# Altium project Research_protoype.PrjPcb
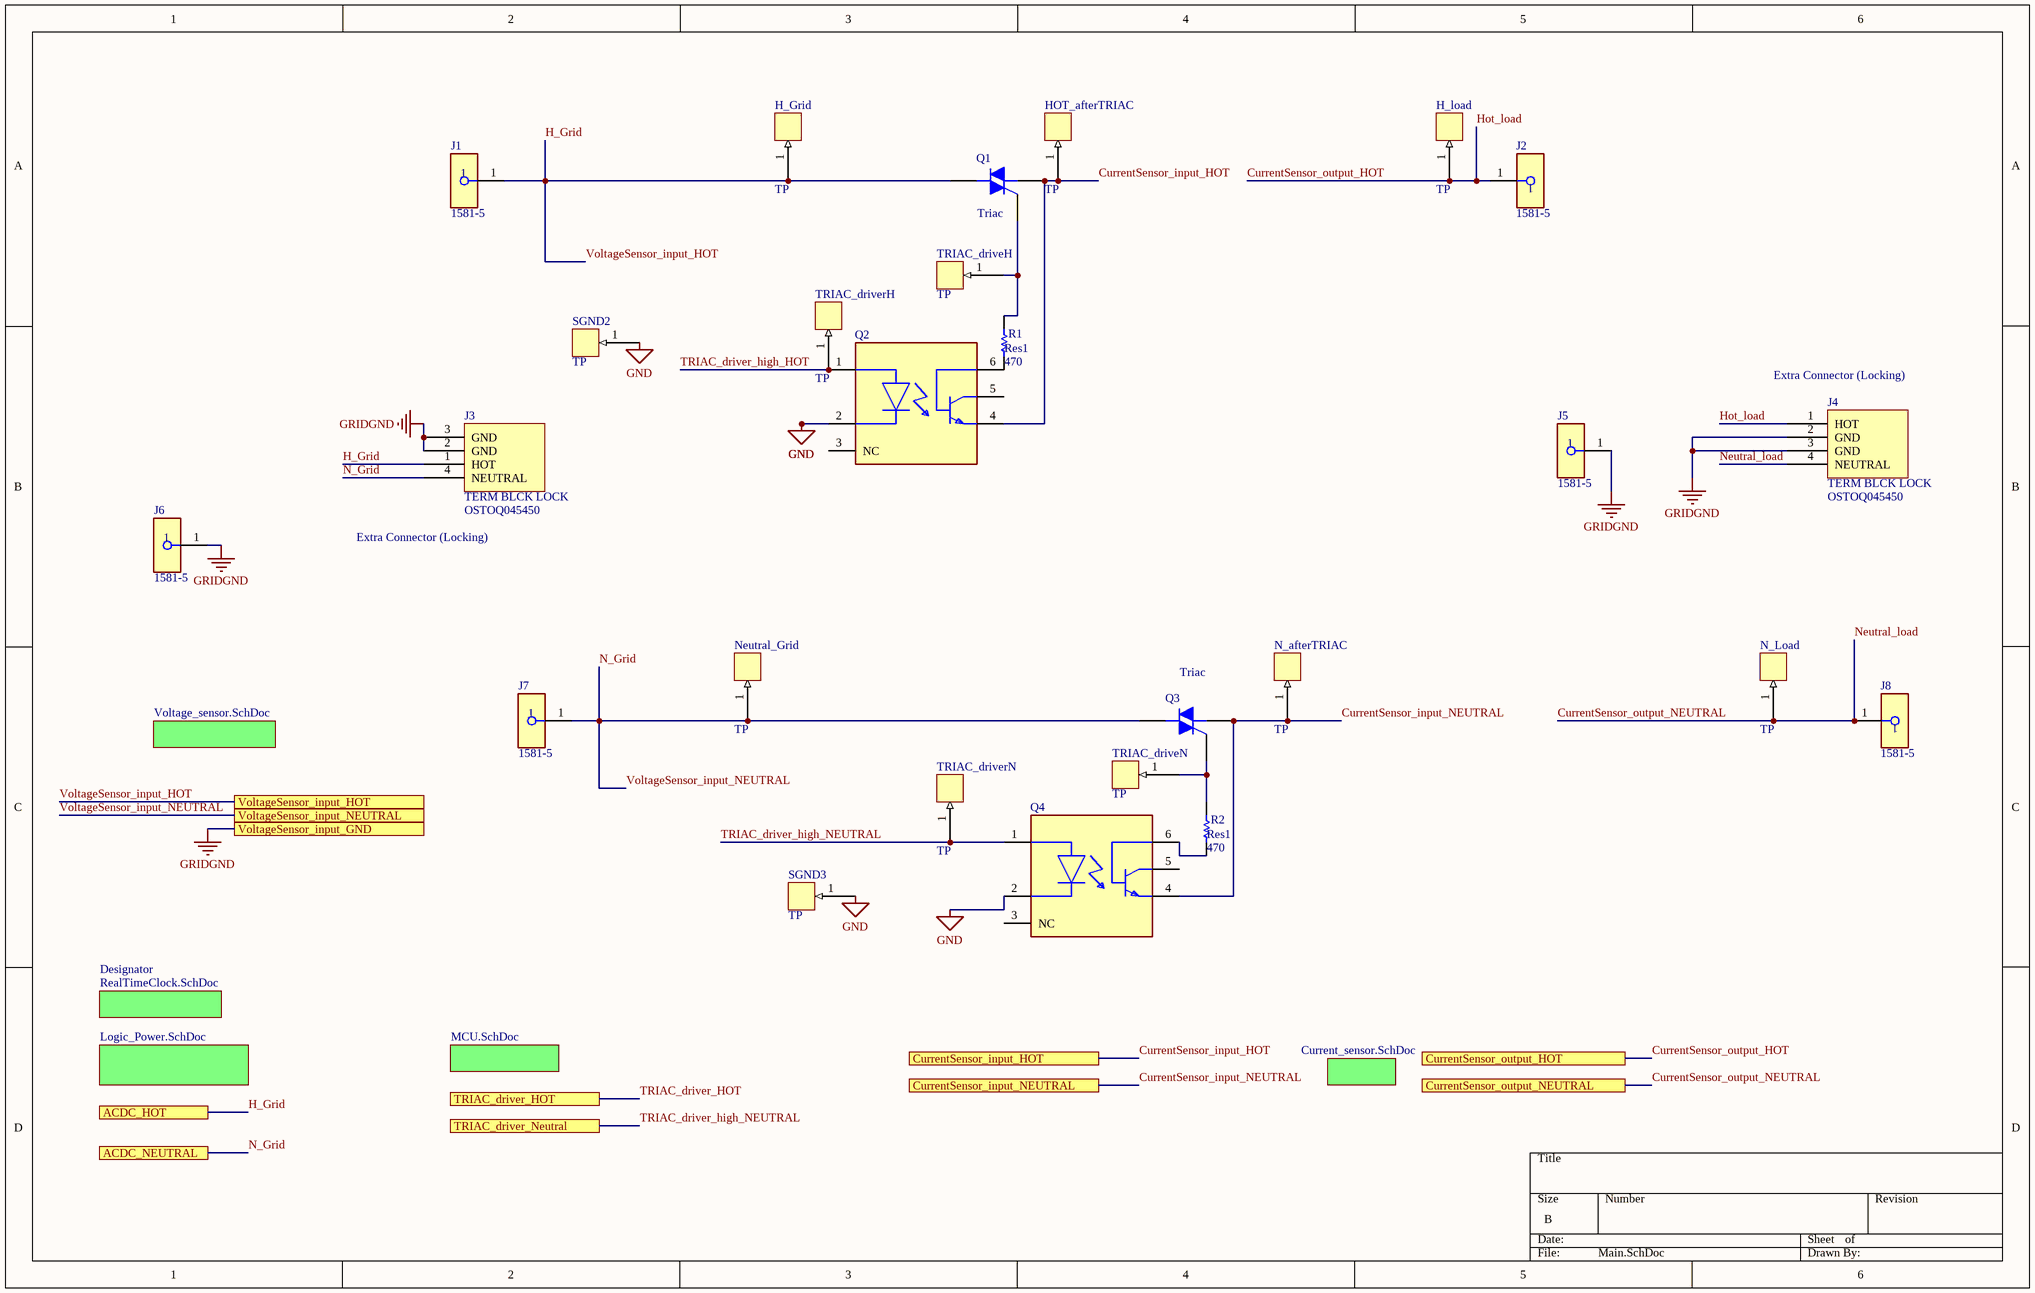
[diagram p0: Main.SchDoc]
6 sheets, 124 parts. Net scope: flat (ports and power ports of the same name join across sheets).
Board file: Research_prototypePCB.PcbDoc
Sheets:
  Main.SchDoc
     = Current_sensor.SchDoc
     = Voltage_sensor.SchDoc
     = MCU.SchDoc
     = Logic_Power.SchDoc
    Designator = RealTimeClock.SchDoc

## Sheet Main.SchDoc
size B; SheetNumber: 1; SheetTotal: 6; SPICEModelCacheZOZTKGSK: <root> / <DocumentId>ZOZTKGSK</DocumentId> / <CacheFrame Number="0"> / <Model Name="mac15a8" Kind="CKT"> / <Text>*MAC15A8 MCE 2-27-96 / *600V 15A pkg:TO-220 2,3,1 / .SUBCKT MAC15A8   1  2  3 / *     TERMINALS: MT2 G MT1 / QN1  5 4 3  NOUT OFF / QN2 11 6 7  NOUT OFF / QP1 6 11 3  POUT OFF / QP2  4 5 7  POUT OFF / DF  4  5  DZ OFF / DR  6 11  DZ OFF / RF  4 6  60MEG / RT2 1 7  18.8M / RH  7 6  87.5 / RGP 8 3  23.1 / RG  2 8  11.5 / RS  8 4  102 / DN  9 2  DIN OFF / RN  9 3  41.6 / GNN  6 7 9 3 15.2M / GNP  4 5 9 3 18.1M / DP 2 10  DIP OFF / RP 10 3  29.5 / GP  7 6 10 3 10.3M / .MODEL DIN  D (IS=45.8F) / .MODEL DIP  D (IS=45.8F N=1.2) / .MODEL DZ   D (IS=45.8F N=1.5 IBV=10U BV=600) / .MODEL POUT PNP (IS=45.8F BF=5 CJE=4.02N TF=38.2U) / .MODEL NOUT NPN (IS=45.8F BF=20 CJE=4.02N CJC=804P TF=2.55U) / .ENDS MAC15A8</Text> / </Model> / </CacheFrame> / </root>

### Parts
(Parts that share a designator on the sheet are numbered #1, #2 ... from top to bottom, then left to right.)
H_Grid#1  TP  [TP]
H_load  TP  [TP]
HOT_afterTRIAC  TP  [TP]
J1  1581-5  [FP-1581-5-MFG]
J2  1581-5  [FP-1581-5-MFG]
J3  OSTOQ045450  [block]
J4  OSTOQ045450  [block]
J5  1581-5  [FP-1581-5-MFG]
J6  1581-5  [FP-1581-5-MFG]
J7  1581-5  [FP-1581-5-MFG]
J8  1581-5  [FP-1581-5-MFG]
N_afterTRIAC  TP  [TP]
N_Load  TP  [TP]
Neutral_Grid  TP  [TP]
Q1  Triac  [TO-220AB]
Q2  (no value)  [FP-22530-MFG]
Q3  Triac  [TO-220AB]
Q4  (no value)  [FP-22530-MFG]
R1  Res1  value 470  [0603]
R2  Res1  value 470  [0603]
SGND2  TP  [TP]
SGND3  TP  [TP]
TRIAC_driveH  TP  [TP]
TRIAC_driveN  TP  [TP]
TRIAC_driverH  TP  [TP]
TRIAC_driverN  TP  [TP]

### Sub-sheets
Designator = RealTimeClock.SchDoc: no entries
? = Current_sensor.SchDoc: no entries
? = Voltage_sensor.SchDoc: no entries
? = MCU.SchDoc: no entries
? = Logic_Power.SchDoc: no entries

### Ports
ACDC_HOT, ACDC_NEUTRAL, CurrentSensor_input_HOT, CurrentSensor_input_NEUTRAL, CurrentSensor_output_HOT, CurrentSensor_output_NEUTRAL, TRIAC_driver_HOT, TRIAC_driver_Neutral, VoltageSensor_input_GND, VoltageSensor_input_HOT, VoltageSensor_input_NEUTRAL

### Nets
GND: Q2.2(C) Q4.2(C) SGND2.1 SGND3.1
GRIDGND: J3.2(GND) J3.3(GND) J4.2(GND) J4.3(GND) J5.1 J6.1 ; port VoltageSensor_input_GND
CurrentSensor_input_HOT: HOT_afterTRIAC.1 Q1.1(M1) Q2.4(E) ; port CurrentSensor_input_HOT
CurrentSensor_input_NEUTRAL: N_afterTRIAC.1 Q3.1(M1) Q4.4(E) ; port CurrentSensor_input_NEUTRAL
CurrentSensor_output_HOT: H_load.1 J2.1 J4.1(HOT) ; port CurrentSensor_output_HOT  [also labelled Hot_load]
CurrentSensor_output_NEUTRAL: J4.4(NEUTRAL) J8.1 N_Load.1 ; port CurrentSensor_output_NEUTRAL  [also labelled Neutral_load]
H_Grid: H_Grid#1.1 J1.1 J3.1(HOT) Q1.2(M2) ; port ACDC_HOT, port VoltageSensor_input_HOT  [also labelled VoltageSensor_input_HOT]
N_Grid: J3.4(NEUTRAL) J7.1 Neutral_Grid.1 Q3.2(M2) ; port ACDC_NEUTRAL, port VoltageSensor_input_NEUTRAL  [also labelled VoltageSensor_input_NEUTRAL]  [project net N]
TRIAC_driver_high_HOT: Q2.1(A) TRIAC_driverH.1
TRIAC_driver_high_NEUTRAL: Q4.1(A) TRIAC_driverN.1 ; port TRIAC_driver_Neutral
NetQ1_3: Q1.3(G) R1.2 TRIAC_driveH.1
NetQ2_6: Q2.6(B) R1.1
NetQ3_3: Q3.3(G) R2.2 TRIAC_driveN.1
NetQ4_6: Q4.6(B) R2.1

Not connected (* = marked no-connect by the designer): Q2 3(NC) 5(C); Q4 3(NC) 5(C)

### Notes on the sheet
- (near J4) Extra Connector (Locking)
- Extra Connector (Locking)
- (in symbol OSTOQ045450) TERM BLCK LOCK

### Library data of the parts
J1 J2 J5-J8 = CMP-73906-000011-1: CONN BANANA JACK TURRET GREEN; Body Material: PC; Number of Contacts: 1; Max Current Rating: 15A; Voltage Rating (AC): 30V; Insulation: Mating End Insulated; Voltage Rating: 2.5kV; Voltage Rating (DC): 60V; Gender: Female; Height: 0.25inch; Mount: Panel; RoHS Compliant: Yes; Length: 1.22inch; Orientation: Straight; Diameter: 4.22mm; Lead Free: Lead Free; Package Quantity: 1; Termination: Turret; Current Rating: 15A; Packaging: Bag; Series: 1581; REACH SVHC: No SVHC; Number of Positions: 1; Contact Plating: Tin; Housing Color: Green; Contact Material: Brass; Insulation Material: Polycarbonate; Weight: 0.126lb; Number of Ports: 1; Color: Green; Housing Material: Polycarbonate; Width: 4inch
Q1 Q3 = Triac: Silicon Bidirectional Triode Thyristor; Note: Pin 2 is electrically connected to Pin 4 (TAB); Published: 29-Sep-2000; LatestRevisionDate: 17-Jul-2002; LatestRevisionNote: Re-released for DXP Platform.; DatasheetVersion: 1999; PackageReference: 369-03; Publisher: Altium Limited; PackageDescription: TO, Thru-Hole, Vertical, Heatsink Mounted; 3 In-Line Leads; Pitch 2.28 mm; ComponentLink2Description: Digikey Link
  Q1: ComponentLink2URL: https://www.digikey.com/en/products/detail/ween-semiconductors/MAC223A6-12a7/1156589
  Q3: ComponentLink2URL: https://www.digikey.com/en/products/detail/ween-semiconductors/MAC223A6-127/1156589
Q2 Q4 = CMP-2000-05429-2: OPTOISO 5KV TRANS W/BASE 6DIP; Max Input Current: 60mA; Max Output Voltage: 70V; Power Dissipation: 150mW; Number of Elements: 1; Voltage Rating (DC): 32V; Reverse Breakdown Voltage: 6V; Fall Time: 14us; Current Transfer Ratio: 200%; Turn-Off Delay Time: 2.3us; Forward Voltage: 1.65V; Max Collector Current: 100mA; Collector Emitter Saturation Voltage: 400mV; Approvals: VDE; Rise Time: 3us; Package Quantity: 2000; Contact Plating: Tin; Max Power Dissipation: 150mW; Packaging: Rail/Tube; Number of Channels: 1; Lead Free: Lead Free; Mount: Through Hole; Output Voltage: 70V; Min Operating Temperature: -55°C; Case/Package: DIP; Forward Current: 60mA; Collector Emitter Voltage (VCEO): 70V; Max Operating Temperature: 100°C; Input Current: 60mA; Radiation Hardening: No; Number of Pins: 6; Output Current per Channel: 100mA; Isolation Voltage: 5kV; Collector Emitter Breakdown Voltage: 70V; Turn-On Delay Time: 3us
R1 R2 = Res1: Resistor; Published: 8-Jun-2000; LatestRevisionDate: 17-Jul-2002; LatestRevisionNote: Re-released for DXP Platform.; PackageReference: AXIAL-0.3; Publisher: Altium Limited; PackageDescription: Axial Device, Thru-Hole; 2 Leads; 0.3 in Pin Spacing

## Sheet Current_sensor.SchDoc
size A; SheetNumber: 3; SheetTotal: 6; SPICEModelCacheOXJWTCKB: <root> / <DocumentId>OXJWTCKB</DocumentId> / <CacheFrame Number="0"> / <Model Name="cap" Kind="MDL"> / <Text>*Default semiconductor capacitor / .MODEL CAP C()</Text> / </Model> / </CacheFrame> / </root>
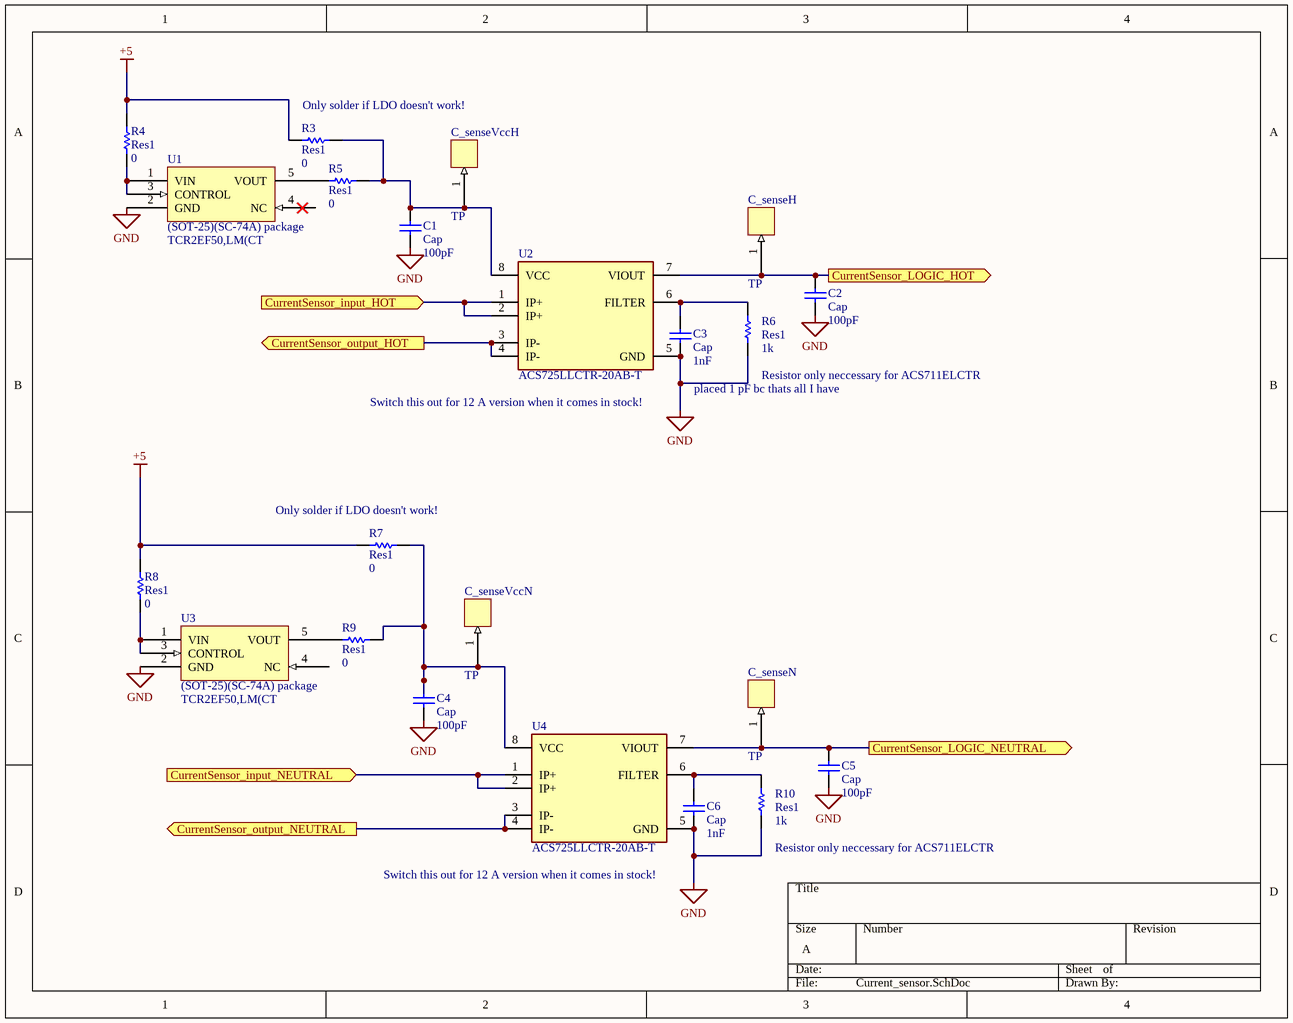
[diagram p1: Current_sensor.SchDoc]

### Parts
C1  Cap  value 100pF  [0603]
C2  Cap  value 100pF  [0603]
C3  Cap  value 1nF  [0603]
C4  Cap  value 100pF  [0603]
C5  Cap  value 100pF  [0603]
C6  Cap  value 1nF  [0603]
C_senseH  TP  [TP]
C_senseN  TP  [TP]
C_senseVccH  TP  [TP]
C_senseVccN  TP  [TP]
R3  Res1  value 0  [0603]
R4  Res1  value 0  [0603]
R5  Res1  value 0  [0603]
R6  Res1  value 1k  [0603]
R7  Res1  value 0  [0603]
R8  Res1  value 0  [0603]
R9  Res1  value 0  [0603]
R10  Res1  value 1k  [0603]
U1  TCR2EF50,LM(CT  [SOT95P275X130-5N]
U2  ACS725LLCTR-20AB-T  [FP-LCN-8-IPC_B]
U3  TCR2EF50,LM(CT  [SOT95P275X130-5N]
U4  ACS725LLCTR-20AB-T  [FP-LCN-8-IPC_B]

### Ports
CurrentSensor_input_HOT (in), CurrentSensor_input_NEUTRAL (in), CurrentSensor_LOGIC_HOT (out), CurrentSensor_LOGIC_NEUTRAL (out), CurrentSensor_output_HOT (out), CurrentSensor_output_NEUTRAL (out)

### Nets
+5: R3.2 R4.1 R7.2 R8.1
GND: C1.1 C2.1 C3.1 C4.1 C5.1 C6.1 R6.1 R10.1 U1.2(GND) U2.5(GND) U3.2(GND) U4.5(GND)
CurrentSensor_input_HOT: U2.1(IP+) U2.2(IP+) ; port CurrentSensor_input_HOT
CurrentSensor_input_NEUTRAL: U4.1(IP+) U4.2(IP+) ; port CurrentSensor_input_NEUTRAL
CurrentSensor_output_HOT: U2.3(IP-) U2.4(IP-) ; port CurrentSensor_output_HOT
CurrentSensor_output_NEUTRAL: U4.3(IP-) U4.4(IP-) ; port CurrentSensor_output_NEUTRAL
NetC1_2: C1.2 C_senseVccH.1 R3.1 R5.1 U2.8(VCC)
NetC2_2: C2.2 C_senseH.1 U2.7(VIOUT) ; port CurrentSensor_LOGIC_HOT
NetC3_2: C3.2 R6.2 U2.6(FILTER)
NetC4_2: C4.2 C_senseVccN.1 R7.1 R9.1 U4.8(VCC)
NetC5_2: C5.2 C_senseN.1 U4.7(VIOUT) ; port CurrentSensor_LOGIC_NEUTRAL
NetC6_2: C6.2 R10.2 U4.6(FILTER)
NetR4_2: R4.2 U1.1(VIN) U1.3(CONTROL)
NetR5_2: R5.2 U1.5(VOUT)
NetR8_2: R8.2 U3.1(VIN) U3.3(CONTROL)
NetR9_2: R9.2 U3.5(VOUT)

Not connected (* = marked no-connect by the designer): U1 4(NC); U3 4(NC)

### Notes on the sheet
- (near R3) Only solder if LDO doesn't work!
- Switch this out for 12 A version when it comes in stock!
- placed 1 pF bc thats all I have
- (near R6) Resistor only neccessary for ACS711ELCTR
- (near R7) Only solder if LDO doesn't work!
- (near R10) Resistor only neccessary for ACS711ELCTR
- (in symbol TCR2EF50,LM(CT) (SOT-25)(SC-74A) package

### Library data of the parts
C1-C6 = Cap: Capacitor; Published: 8-Jun-2000; LatestRevisionDate: 17-Jul-2002; LatestRevisionNote: Re-released for DXP Platform.; PackageReference: RAD-0.3; Publisher: Altium Limited; PackageDescription: Radial Cap, Thru-Hole; 2 Leads; 0.3 in Pin Spacing
R3-R10 = Res1: Resistor; Published: 8-Jun-2000; LatestRevisionDate: 17-Jul-2002; LatestRevisionNote: Re-released for DXP Platform.; PackageReference: AXIAL-0.3; Publisher: Altium Limited; PackageDescription: Axial Device, Thru-Hole; 2 Leads; 0.3 in Pin Spacing
U2 U4 = CMP-82923-000001-3: SENSOR CURRENT HALL 20A AC/DC; Accuracy: 0.8%; Linearity: 1.5%; Polarity: Bidirectional; Bandwidth: 120kHz; Number of Channels: 1; Sensitivity: 66mV/A; Quiescent Current: 10mA; Response Time: 4us; Max Supply Current: 14mA; Frequency: 120kHz; Min Operating Temperature: -40°C; Max Operating Temperature: 150°C; Case/Package: SOIC; Current Sensing: 20A; Packaging: Tape and Reel; Number of Pins: 8; Mount: Surface Mount; RoHS Compliant: Yes

## Sheet Voltage_sensor.SchDoc
size B; SheetNumber: 5; SheetTotal: 6; SPICEModelCacheSCQTRBCW: <root> / <DocumentId>SCQTRBCW</DocumentId> / <CacheFrame Number="0"> / <Model Name="cap" Kind="MDL"> / <Text>*Default semiconductor capacitor / .MODEL CAP C()</Text> / </Model> / <Model Name="zener" Kind="MDL"> / <Text>*ZENER / *Default Zener 10V @ 10mA / *Zener Diode Pinout: A,K / .MODEL ZENER D( BV=10 IBV=10E-3 )</Text> / </Model> / </CacheFrame> / </root>
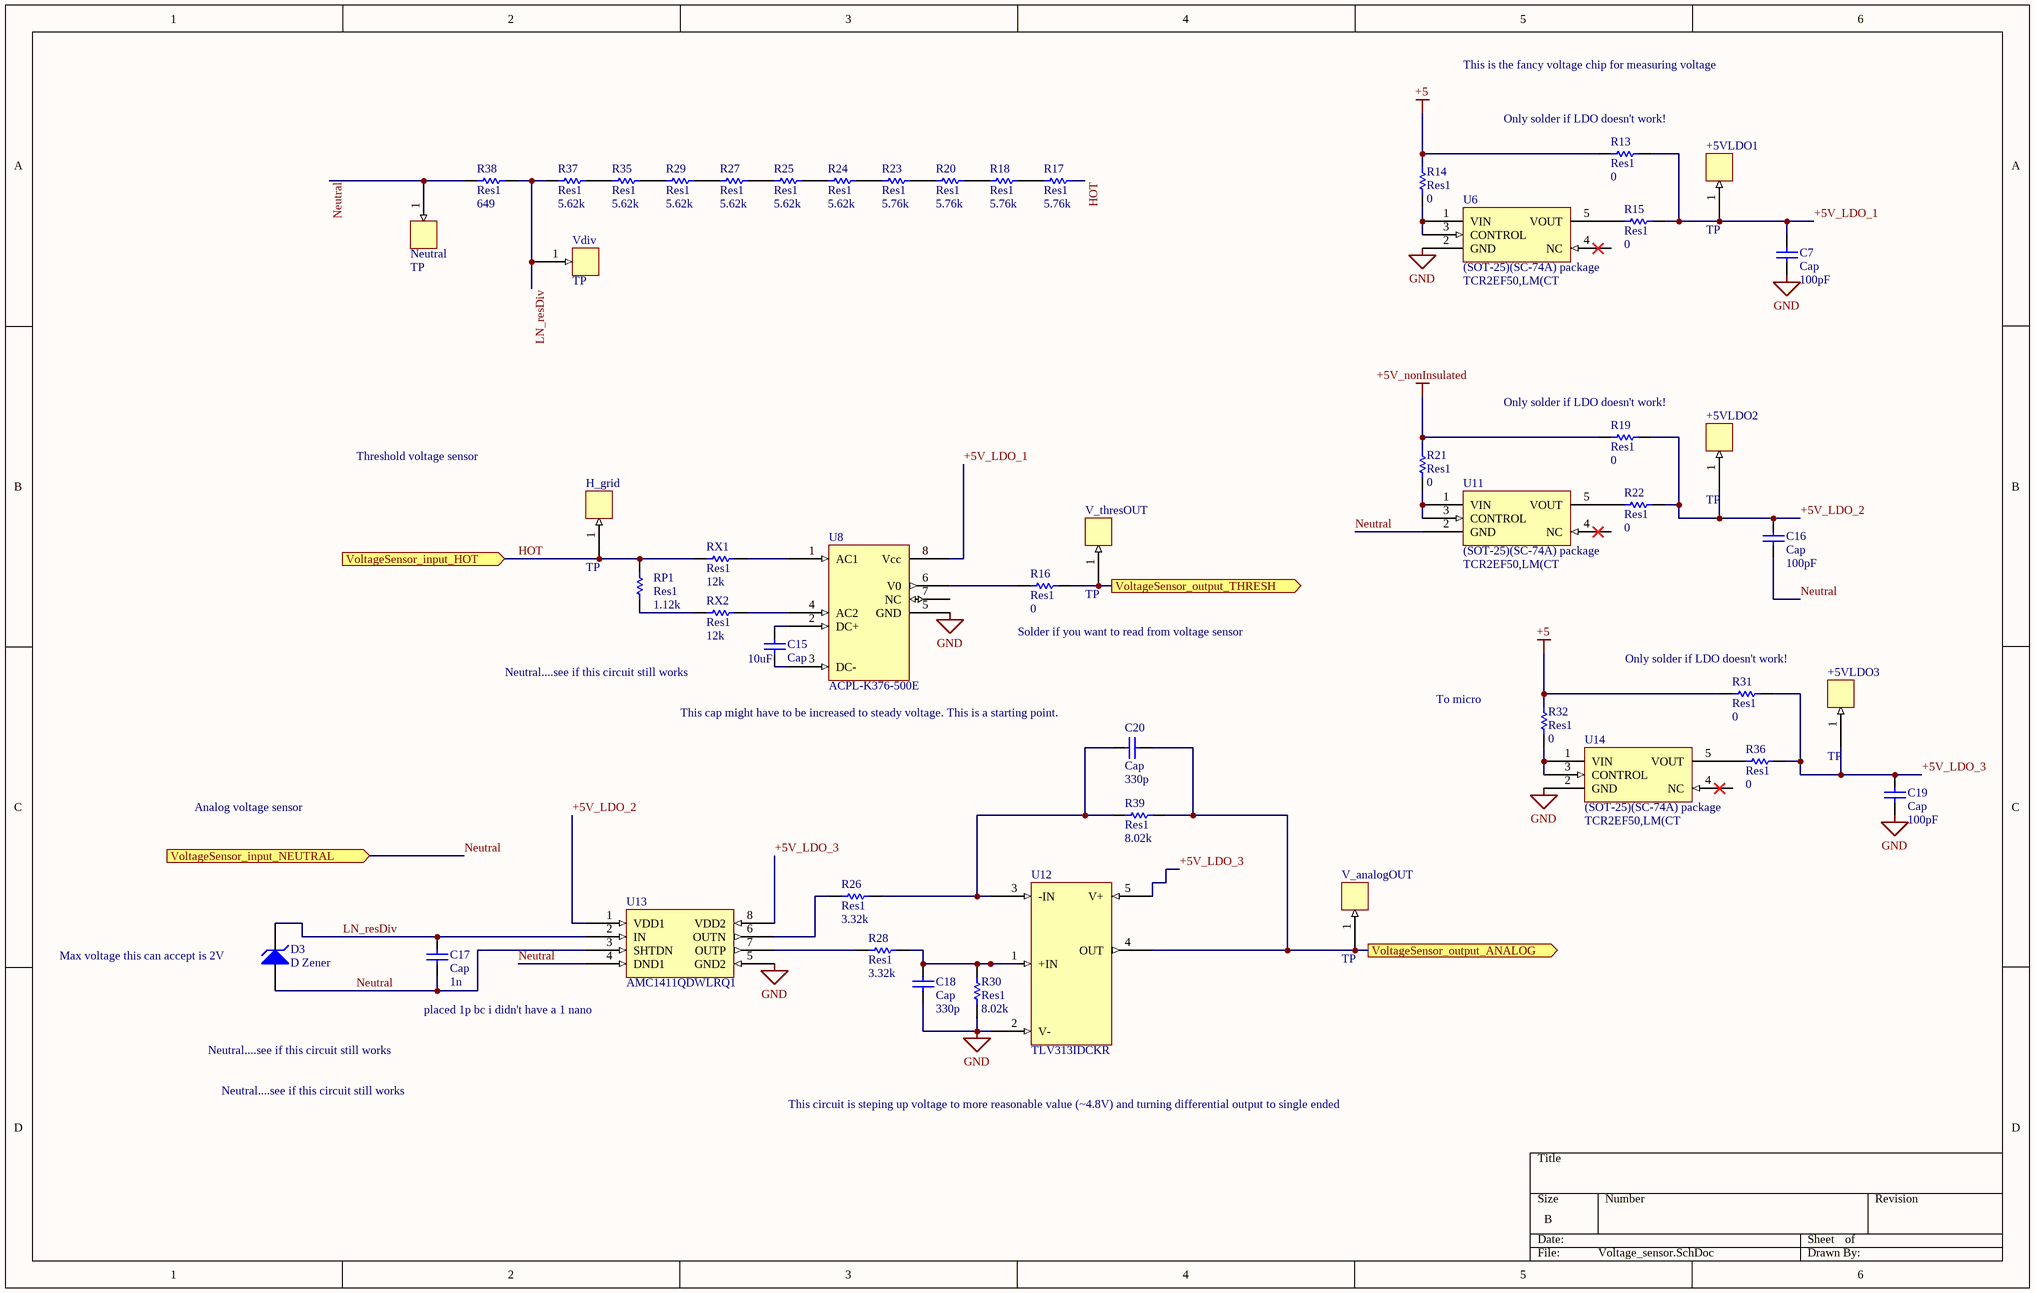
[diagram p2: Voltage_sensor.SchDoc]

### Parts
(Parts that share a designator on the sheet are numbered #1, #2 ... from top to bottom, then left to right.)
+5VLDO1  TP  [TP]
+5VLDO2  TP  [TP]
+5VLDO3  TP  [TP]
C7  Cap  value 100pF  [0603]
C15  Cap  value 10uF  [0603]
C16  Cap  value 100pF  [0603]
C17  Cap  value 1n  [0603]
C18  Cap  value 330p  [0603]
C19  Cap  value 100pF  [0603]
C20  Cap  value 330p  [0603]
D3  D Zener  [SOT23_N]
H_grid#2  TP  [TP]
Neutral  TP  [TP]
R13  Res1  value 0  [0603]
R14  Res1  value 0  [0603]
R15  Res1  value 0  [0603]
R16  Res1  value 0  [0603]
R17  Res1  value 5.76k  [0603]
R18  Res1  value 5.76k  [0603]
R19  Res1  value 0  [0603]
R20  Res1  value 5.76k  [0603]
R21  Res1  value 0  [0603]
R22  Res1  value 0  [0603]
R23  Res1  value 5.76k  [0603]
R24  Res1  value 5.62k  [0603]
R25  Res1  value 5.62k  [0603]
R26  Res1  value 3.32k  [0603]
R27  Res1  value 5.62k  [0603]
R28  Res1  value 3.32k  [0603]
R29  Res1  value 5.62k  [0603]
R30  Res1  value 8.02k  [0603]
R31  Res1  value 0  [0603]
R32  Res1  value 0  [0603]
R35  Res1  value 5.62k  [0603]
R36  Res1  value 0  [0603]
R37  Res1  value 5.62k  [0603]
R38  Res1  value 649  [0603]
R39  Res1  value 8.02k  [0603]
RP1  Res1  value 1.12k  [0603]
RX1  Res1  value 12k  [0603]
RX2  Res1  value 12k  [0603]
U6  TCR2EF50,LM(CT  [SOT95P275X130-5N]
U8  ACPL-K376-500E  [ACPL-K376-500E]
U11  TCR2EF50,LM(CT  [SOT95P275X130-5N]
U12  TLV313IDCKR  [TLV313IDCKR]
U13  AMC1411QDWLRQ1  [AMC1411QDWLRQ1]
U14  TCR2EF50,LM(CT  [SOT95P275X130-5N]
V_analogOUT  TP  [TP]
V_thresOUT  TP  [TP]
Vdiv  TP  [TP]

### Ports
VoltageSensor_input_HOT (in), VoltageSensor_input_NEUTRAL (in), VoltageSensor_output_ANALOG (out), VoltageSensor_output_THRESH (out)

### Nets
+5: R13.2 R14.1 R31.2 R32.1
+5V_nonInsulated: R19.2 R21.1
GND: C7.1 C18.2 C19.1 R30.1 U6.2(GND) U8.5(GND) U12.2(V-) U13.5(GND2) U14.2(GND)
+5V_LDO_1: +5VLDO1.1 C7.2 R13.1 R15.1 U8.8(Vcc)
+5V_LDO_2: +5VLDO2.1 C16.2 R19.1 R22.1 U13.1(VDD1)
+5V_LDO_3: +5VLDO3.1 C19.2 R31.1 R36.1 U12.5(V+) U13.8(VDD2)
HOT: H_grid#2.1 R17.1 RP1.2 RX1.2 ; port VoltageSensor_input_HOT  [project net H_Grid]
LN_resDiv: C17.2 D3.2(K) R37.2 R38.1 U13.2(IN) Vdiv.1
Neutral: C16.1 C17.1 D3.1(A) Neutral.1 R38.2 U11.2(GND) U13.3(SHTDN) U13.4(DND1) ; port VoltageSensor_input_NEUTRAL  [project net N]
NetC15_1: C15.1 U8.3(DC-)
NetC15_2: C15.2 U8.2(DC+)
NetC18_1: C18.1 R28.2 R30.2 U12.1(+IN)
NetC20_1: C20.1 R26.2 R39.1 U12.3(-IN)
NetC20_2: C20.2 R39.2 U12.4(OUT) V_analogOUT.1 ; port VoltageSensor_output_ANALOG
NetR14_2: R14.2 U6.1(VIN) U6.3(CONTROL)
NetR15_2: R15.2 U6.5(VOUT)
NetR16_1: R16.1 V_thresOUT.1 ; port VoltageSensor_output_THRESH
NetR16_2: R16.2 U8.6(V0)
NetR17_2: R17.2 R18.2
NetR18_1: R18.1 R20.1
NetR20_2: R20.2 R23.1
NetR21_2: R21.2 U11.1(VIN) U11.3(CONTROL)
NetR22_2: R22.2 U11.5(VOUT)
NetR23_2: R23.2 R24.1
NetR24_2: R24.2 R25.1
NetR25_2: R25.2 R27.1
NetR26_1: R26.1 U13.6(OUTN)
NetR27_2: R27.2 R29.1
NetR28_1: R28.1 U13.7(OUTP)
NetR29_2: R29.2 R35.1
NetR32_2: R32.2 U14.1(VIN) U14.3(CONTROL)
NetR35_2: R35.2 R37.1
NetR36_2: R36.2 U14.5(VOUT)
NetRP1_1: RP1.1 RX2.2
NetRX1_1: RX1.1 U8.1(AC1)
NetRX2_1: RX2.1 U8.4(AC2)

Not connected (* = marked no-connect by the designer): U6 4(NC); U8 7(NC); U11 4(NC); U14 4(NC)

### Notes on the sheet
- This is the fancy voltage chip for measuring voltage
- (near R13) Only solder if LDO doesn't work!
- (near R19) Only solder if LDO doesn't work!
- Threshold voltage sensor
- (near R16) Solder if you want to read from voltage sensor
- (near C15) Neutral....see if this circuit still works
- To micro
- (near R31) Only solder if LDO doesn't work!
- This cap might have to be increased to steady voltage. This is a starting point.
- Analog voltage sensor
- (near D3) Max voltage this can accept is 2V
- placed 1p bc i didn't have a 1 nano
- Neutral....see if this circuit still works
- This circuit is steping up voltage to more reasonable value (~4.8V) and turning differential output to single ended
- (in symbol TCR2EF50,LM(CT) (SOT-25)(SC-74A) package

### Library data of the parts
C7 C15-C20 = Cap: Capacitor; Published: 8-Jun-2000; LatestRevisionDate: 17-Jul-2002; LatestRevisionNote: Re-released for DXP Platform.; PackageReference: RAD-0.3; Publisher: Altium Limited; PackageDescription: Radial Cap, Thru-Hole; 2 Leads; 0.3 in Pin Spacing
D3 = D Zener: https://www.mouser.com/ProductDetail/Taiwan-Semiconductor/TSZU52C4V7-RGG?qs=5aG0NVq1C4yA6BT7gqMcyA%3D%3D; Published: 8-Jun-2000; LatestRevisionDate: 17-Jul-2002; LatestRevisionNote: Re-released for DXP Platform.; PackageReference: DIODE-0.7; Publisher: Altium Limited; PackageDescription: Diode, Thru-Hole; 2 Leads; 0.7 in Pin Spacing; ComponentLink1Description: New link; ComponentLink1URL: *; ComponentLink2Description: New link 1; ComponentLink2URL: *
R13-R32 R35-R39 RP1 RX1 RX2 = Res1: Resistor; Published: 8-Jun-2000; LatestRevisionDate: 17-Jul-2002; LatestRevisionNote: Re-released for DXP Platform.; PackageReference: AXIAL-0.3; Publisher: Altium Limited; PackageDescription: Axial Device, Thru-Hole; 2 Leads; 0.3 in Pin Spacing
U12 = TLV313IDCKR: https://www.mouser.com/ProductDetail/Texas-Instruments/TLV313IDCKR?qs=8%252Br4Hz5Xir8P1rgivePgtw%3D%3D; ComponentLink1Description: digikey; ComponentLink1URL: https://www.mouser.com/ProductDetail/Texas-Instruments/TLV313IDCKR?qs=8%252Br4Hz5Xir8P1rgivePgtw%3D%3D; ComponentLink2Description: New link; ComponentLink2URL: *; ComponentLink3Description: New link 1; ComponentLink3URL: *
U13 = AMC1411QDWLRQ1: mouser: https://www.mouser.com/ProductDetail/Texas-Instruments/AMC1411QDWLRQ1?qs=Rp5uXu7WBW9VgWcI1l5sjg%3D%3D; ComponentLink1Description: New link; ComponentLink1URL: *; ComponentLink2Description: New link 1; ComponentLink2URL: *

## Sheet MCU.SchDoc
size A; SheetNumber: 4; SheetTotal: 6; SPICEModelCacheDXVWNVZD: <root> / <DocumentId>DXVWNVZD</DocumentId> / <CacheFrame Number="0"> / <Model Name="diode" Kind="MDL"> / <Text>*Default Diode / *Diode Pinout: A,K / .MODEL DIODE D()</Text> / </Model> / </CacheFrame> / </root>
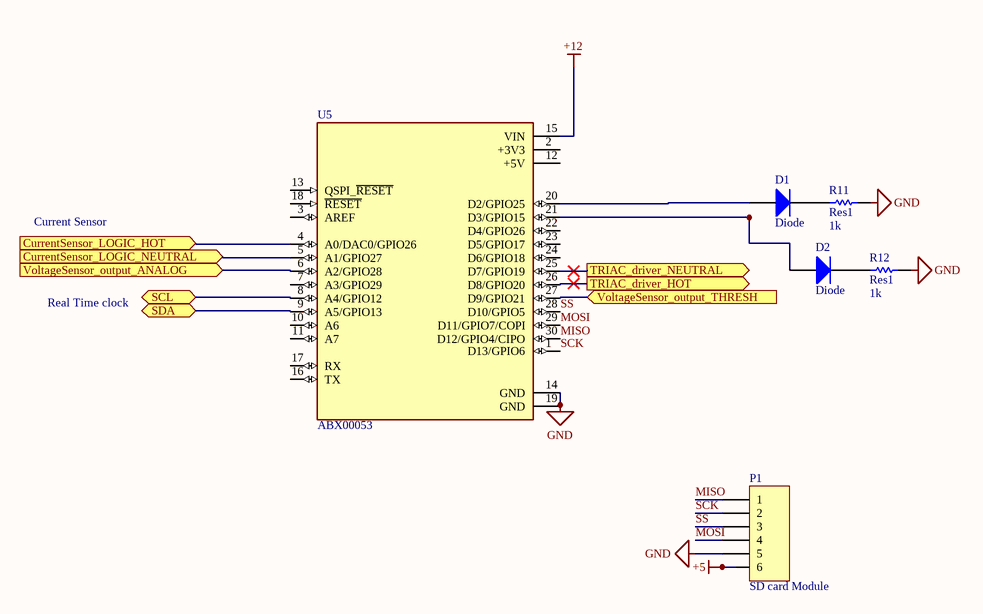
[diagram p3: MCU.SchDoc]

### Parts
D1  Diode  [0603]
D2  Diode  [0603]
P1  SD card Module  [HDR1X6]
R11  Res1  value 1k  [0603]
R12  Res1  value 1k  [0603]
U5  ABX00053  [MODULE_ABX00053]

### Ports
CurrentSensor_LOGIC_HOT (in), CurrentSensor_LOGIC_NEUTRAL (in), SCL (bidir), SDA (bidir), TRIAC_driver_HOT (out), TRIAC_driver_NEUTRAL (out), VoltageSensor_output_ANALOG (in), VoltageSensor_output_THRESH (in)

### Nets
+5: P1.6
+12: U5.15(VIN)
GND: P1.5 R11.1 R12.1 U5.14(GND) U5.19(GND)
MISO: P1.1 U5.30(D12/GPIO4/CIPO)
MOSI: P1.4 U5.29(D11/GPIO7/COPI)
SCK: P1.2 U5.1(D13/GPIO6)
SCL: U5.8(A4/GPIO12) ; port SCL
SDA: U5.9(A5/GPIO13) ; port SDA
SS: P1.3 U5.28(D10/GPIO5)
TRIAC_driver_high_NEUTRAL: U5.25(D7/GPIO19) ; port TRIAC_driver_NEUTRAL
TRIAC_driver_HOT: U5.26(D8/GPIO20) ; port TRIAC_driver_HOT
NetC2_2: U5.4(A0/DAC0/GPIO26) ; port CurrentSensor_LOGIC_HOT
NetC5_2: U5.5(A1/GPIO27) ; port CurrentSensor_LOGIC_NEUTRAL
NetC20_2: U5.6(A2/GPIO28) ; port VoltageSensor_output_ANALOG
NetD1_1: D1.1(A) U5.20(D2/GPIO25)
NetD1_2: D1.2(K) R11.2
NetD2_1: D2.1(A) U5.21(D3/GPIO15)
NetD2_2: D2.2(K) R12.2
NetR16_1: U5.27(D9/GPIO21) ; port VoltageSensor_output_THRESH

Not connected (* = marked no-connect by the designer): U5 2(+3V3) 3(AREF) 7(A3/GPIO29) 10(A6) 11(A7) 12(+5V) 13(QSPI_~{RESET}) 16(TX) 17(RX) 18(~{RESET}) 22(D4/GPIO26) 23(D5/GPIO17) 24(D6/GPIO18)

### Notes on the sheet
- Current Sensor
- Real Time clock

### Library data of the parts
D1 D2 = Diode: Default Diode; Published: 8-Jun-2000; LatestRevisionDate: 17-Jul-2002; LatestRevisionNote: Re-released for DXP Platform.; PackageVersion: Sep-1996; PackageReference: SMC; Publisher: Altium Limited; PackageDescription: DO-214-AB/SMC; 2 C-Bend Leads; Body 7.9 x 5.9 mm, inc. leads (LxW); Code_JEDEC: DO-214-AB
P1 = Header 6: Header, 6-Pin; LatestRevisionDate: 17-Jul-2002; LatestRevisionNote: Re-released for DXP Platform.; Publisher: Altium Limited
R11 R12 = Res1: Resistor; Published: 8-Jun-2000; LatestRevisionDate: 17-Jul-2002; LatestRevisionNote: Re-released for DXP Platform.; PackageReference: AXIAL-0.3; Publisher: Altium Limited; PackageDescription: Axial Device, Thru-Hole; 2 Leads; 0.3 in Pin Spacing
U5 = ABX00053: NINA-W102, RP2040 Arduino Nano RP2040 Connect with Headers series ARMÂ® CortexÂ®-M0+ MCU 32-Bit Embedded Evaluation Board; Value: *; SnapEDA_Link: https://www.snapeda.com/parts/ABX00053/Arduino/view-part/?ref=snap; MF: Arduino; Purchase-URL: https://pricing.snapeda.com/search/part/ABX00053/?ref=eda; Check_prices: https://www.snapeda.com/parts/ABX00053/Arduino/view-part/?ref=eda; Digi-Key_Part_Number: 1050-ABX00053-ND; Package: None; MP: ABX00053

## Sheet Logic_Power.SchDoc
size Legal; SheetNumber: 6; SheetTotal: 6; SPICEModelCacheVPXTNZOZ: <root> / <DocumentId>VPXTNZOZ</DocumentId> / <CacheFrame Number="0"> / <Model Name="cap" Kind="MDL"> / <Text>*Default semiconductor capacitor / .MODEL CAP C()</Text> / </Model> / </CacheFrame> / </root>
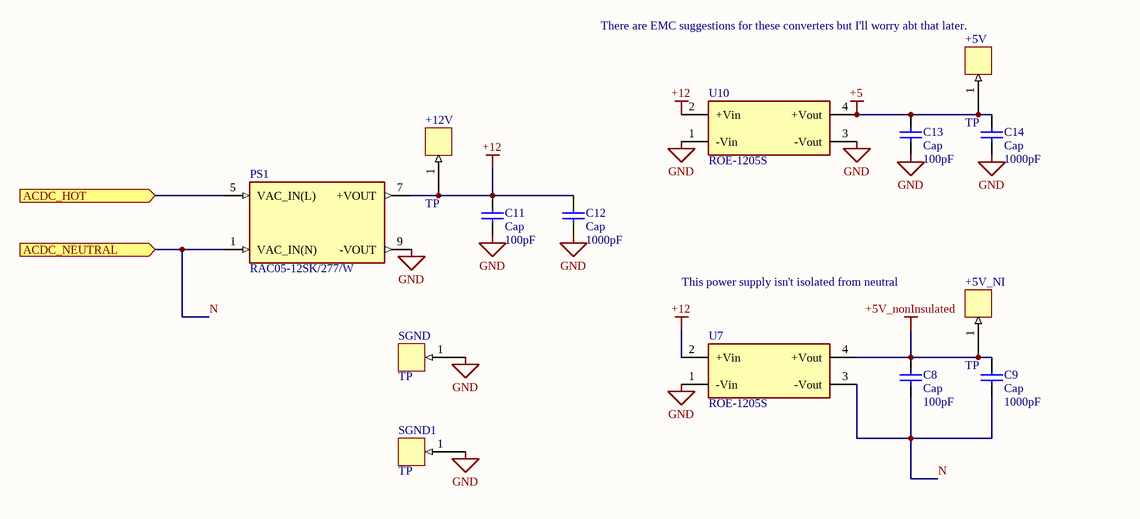
[diagram p4: Logic_Power.SchDoc]

### Parts
+5V  TP  [TP]
+5V_NI  TP  [TP]
+12V  TP  [TP]
C8  Cap  value 100pF  [0603]
C9  Cap  value 1000pF  [0603]
C11  Cap  value 100pF  [0603]
C12  Cap  value 1000pF  [0603]
C13  Cap  value 100pF  [0603]
C14  Cap  value 1000pF  [0603]
PS1  RAC05-12SK/277/W  [CONV_RAC05-12SK/277/W]
SGND  TP  [TP]
SGND1  TP  [TP]
U7  ROE-1205S  [FP-ROE-0505S-MFG]
U10  ROE-1205S  [FP-ROE-0505S-MFG]

### Ports
ACDC_HOT (in), ACDC_NEUTRAL (in)

### Nets
+5: +5V.1 C13.2 C14.2 U10.4(+Vout)
+5V_nonInsulated: +5V_NI.1 C8.2 C9.2 U7.4(+Vout)
+12: +12V.1 C11.2 C12.2 PS1.7(+VOUT) U7.2(+Vin) U10.2(+Vin)
GND: C11.1 C12.1 C13.1 C14.1 PS1.9(-VOUT) SGND.1 SGND1.1 U7.1(-Vin) U10.1(-Vin) U10.3(-Vout)
H_Grid: PS1.5(VAC_IN(L)) ; port ACDC_HOT
N: C8.1 C9.1 PS1.1(VAC_IN(N)) U7.3(-Vout) ; port ACDC_NEUTRAL

### Notes on the sheet
- (near +5V) There are EMC suggestions for these converters but I'll worry abt that later.
- (near +5V_NI) This power supply isn't isolated from neutral

### Library data of the parts
C8 C9 C11-C14 = Cap: Capacitor; Published: 8-Jun-2000; LatestRevisionDate: 17-Jul-2002; LatestRevisionNote: Re-released for DXP Platform.; PackageReference: RAD-0.3; Publisher: Altium Limited; PackageDescription: Radial Cap, Thru-Hole; 2 Leads; 0.3 in Pin Spacing
PS1 = RAC05-12SK/277/W: 5W AC/DC-Converter 'POWERLINE' W 4kV reg; MF: Recom Power; SnapEDA_Link: https://www.snapeda.com/parts/RAC05-12SK/277/W/Recom%20Power/view-part/3227993/?ref=snap; Price: None; Availability: Unavailable; MP: RAC05-12SK/277/W; Value: *; Package: Recom Power
U7 U10 = CMP-29842-000013-1: DC DC CONVERTER 5V 1W; Efficiency: 75%; Current - Output 1: 200mA; Isolation: Isolated; Max Input Voltage: 5.5V; Min Input Voltage: 4.5V; Number of Outputs: 1; Isolation Voltage: 1kV; RoHS Compliant: Yes; Depth: 6mm; Height: 10mm; Max Output Voltage: 5V; Power Rating: 1W; Case/Package: SIP; Nominal Output Voltage: 5V; Weight: 1.4g; Min Operating Temperature: -40°C; Max Output Current: 200mA; Output Power: 1W; Min Input Voltage (DC): 4.5V; Max Power Dissipation: 1W; REACH SVHC: No SVHC; Series: ROE; Output Current: 200mA; Width: 6mm; Number of Pins: 4; Package Quantity: 42; Lead Free: Lead Free; Mount: Through Hole; Packaging: Rail/Tube; Length: 11.5mm; Output Voltage: 5V; Max Operating Temperature: 85°C; Voltage - Output 1: 5V; Nominal Input Voltage: 5V; Max Input Voltage (DC): 5.5V; Max Output Power: 1W

## Sheet RealTimeClock.SchDoc
size A; SheetNumber: 2; SheetTotal: 6; SPICEModelCacheFCKXXZSW: <root> / <DocumentId>FCKXXZSW</DocumentId> / <CacheFrame Number="0"> / <Model Name="cap" Kind="MDL"> / <Text>*Default semiconductor capacitor / .MODEL CAP C()</Text> / </Model> / </CacheFrame> / </root>
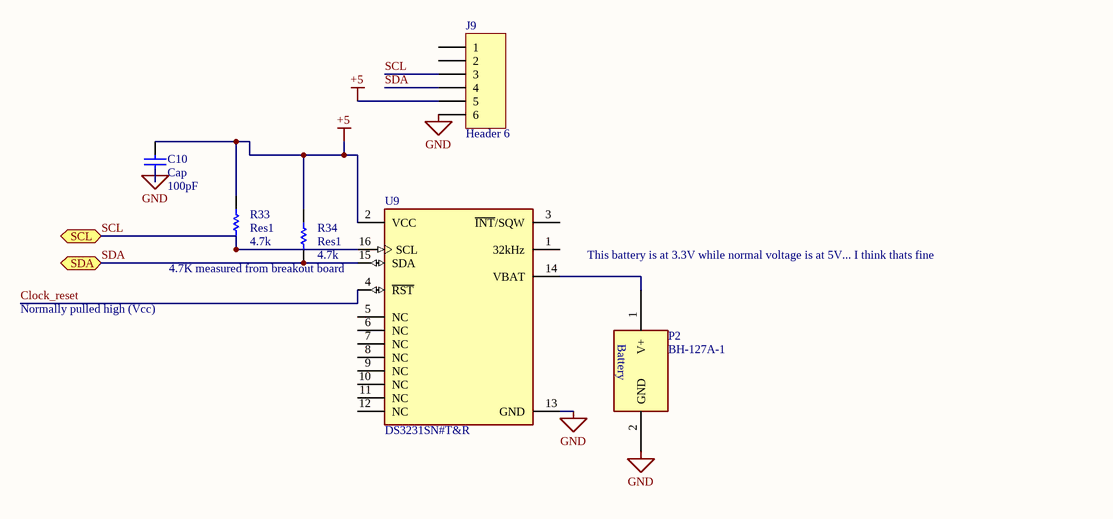
[diagram p5: RealTimeClock.SchDoc]

### Parts
C10  Cap  value 100pF  [0603]
J9  Header 6  [HDR1X6]
P2  BH-127A-1  [banana]
R33  Res1  value 4.7k  [0603]
R34  Res1  value 4.7k  [0603]
U9  DS3231SN#T&R  [FP-W16-H2-MFG]

### Ports
SCL (bidir), SDA (bidir)

### Nets
+5: C10.2 J9.5 R33.2 R34.2 U9.2(VCC)
GND: C10.1 J9.6 P2.2(GND) U9.13(GND)
Clock_reset: U9.4(~{RST})
SCL: J9.3 R33.1 U9.16(SCL) ; port SCL
SDA: J9.4 R34.1 U9.15(SDA) ; port SDA
NetP2_1: P2.1(V+) U9.14(VBAT)

Not connected (* = marked no-connect by the designer): J9 1 2; U9 1(32kHz) 3(~{INT}/SQW) 5(NC) 6(NC) 7(NC) 8(NC) 9(NC) 10(NC) 11(NC) 12(NC)

### Notes on the sheet
- 4.7K measured from breakout board
- This battery is at 3.3V while normal voltage is at 5V... I think thats fine
- Normally pulled high (Vcc)
- (in symbol BH-127A-1) Battery

### Library data of the parts
C10 = Cap: Capacitor; Published: 8-Jun-2000; LatestRevisionDate: 17-Jul-2002; LatestRevisionNote: Re-released for DXP Platform.; PackageReference: RAD-0.3; Publisher: Altium Limited; PackageDescription: Radial Cap, Thru-Hole; 2 Leads; 0.3 in Pin Spacing
J9 = Header 6: Header, 6-Pin; LatestRevisionDate: 17-Jul-2002; LatestRevisionNote: Re-released for DXP Platform.; Publisher: Altium Limited
R33 R34 = Res1: Resistor; Published: 8-Jun-2000; LatestRevisionDate: 17-Jul-2002; LatestRevisionNote: Re-released for DXP Platform.; PackageReference: AXIAL-0.3; Publisher: Altium Limited; PackageDescription: Axial Device, Thru-Hole; 2 Leads; 0.3 in Pin Spacing
U9 = CMP-0254-00375-2: IC RTC CLK/CALENDAR I2C 16-SOIC; Operating Supply Voltage: 3.3V; Max Supply Voltage: 5.5V; Logic Function: Clock; Time Format: HH:MM:SS; Date Format: YY-MM-DD-dd; Min Supply Voltage: 2.3V; Min Operating Temperature: -40°C; Packaging: Tape and Reel; Radiation Hardening: No; Package Quantity: 1000; Case/Package: SOIC; Max Operating Temperature: 85°C; Lead Free: Lead Free; Interface: I2C; Contact Plating: Tin; Number of Pins: 16; Mount: Surface Mount

## Nets that join several sheets
+5: Current_sensor (R3.2 R4.1 R7.2 R8.1), Voltage_sensor (R13.2 R14.1 R31.2 R32.1), MCU (P1.6), Logic_Power (+5V.1 C13.2 C14.2 U10.4), RealTimeClock (5 pins)
+5V_nonInsulated: Voltage_sensor (R19.2 R21.1), Logic_Power (+5V_NI.1 C8.2 C9.2 U7.4)
+12: MCU (U5.15), Logic_Power (6 pins)
GND: Main (Q2.2 Q4.2 SGND2.1 SGND3.1), Current_sensor (12 pins), Voltage_sensor (9 pins), MCU (5 pins), Logic_Power (10 pins), RealTimeClock (C10.1 J9.6 P2.2 U9.13)
CurrentSensor_input_HOT: Main (HOT_afterTRIAC.1 Q1.1 Q2.4), Current_sensor (U2.1 U2.2)
CurrentSensor_input_NEUTRAL: Main (N_afterTRIAC.1 Q3.1 Q4.4), Current_sensor (U4.1 U4.2)
CurrentSensor_output_HOT: Main (H_load.1 J2.1 J4.1), Current_sensor (U2.3 U2.4)
CurrentSensor_output_NEUTRAL: Main (J4.4 J8.1 N_Load.1), Current_sensor (U4.3 U4.4)
H_Grid: Main (H_Grid#1.1 J1.1 J3.1 Q1.2), Voltage_sensor (H_grid#2.1 R17.1 RP1.2 RX1.2), Logic_Power (PS1.5)
N: Main (J3.4 J7.1 Neutral_Grid.1 Q3.2), Voltage_sensor (8 pins), Logic_Power (C8.1 C9.1 PS1.1 U7.3)
NetC2_2: Current_sensor (C2.2 C_senseH.1 U2.7), MCU (U5.4)
NetC5_2: Current_sensor (C5.2 C_senseN.1 U4.7), MCU (U5.5)
NetC20_2: Voltage_sensor (C20.2 R39.2 U12.4 V_analogOUT.1), MCU (U5.6)
NetR16_1: Voltage_sensor (R16.1 V_thresOUT.1), MCU (U5.27)
SCL: MCU (U5.8), RealTimeClock (J9.3 R33.1 U9.16)
SDA: MCU (U5.9), RealTimeClock (J9.4 R34.1 U9.15)
TRIAC_driver_high_NEUTRAL: Main (Q4.1 TRIAC_driverN.1), MCU (U5.25)